# Altium schematic sheet Reflow.SchDoc
size A4
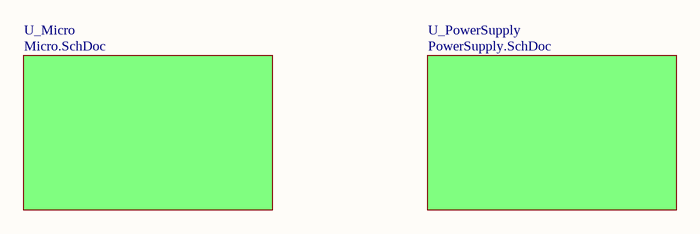
[diagram p0: Reflow.SchDoc]

## Sub-sheets
U_Micro = Micro.SchDoc: no entries
U_PowerSupply = PowerSupply.SchDoc: no entries